# EAGLE design dac connector board (EAGLE 6.3)
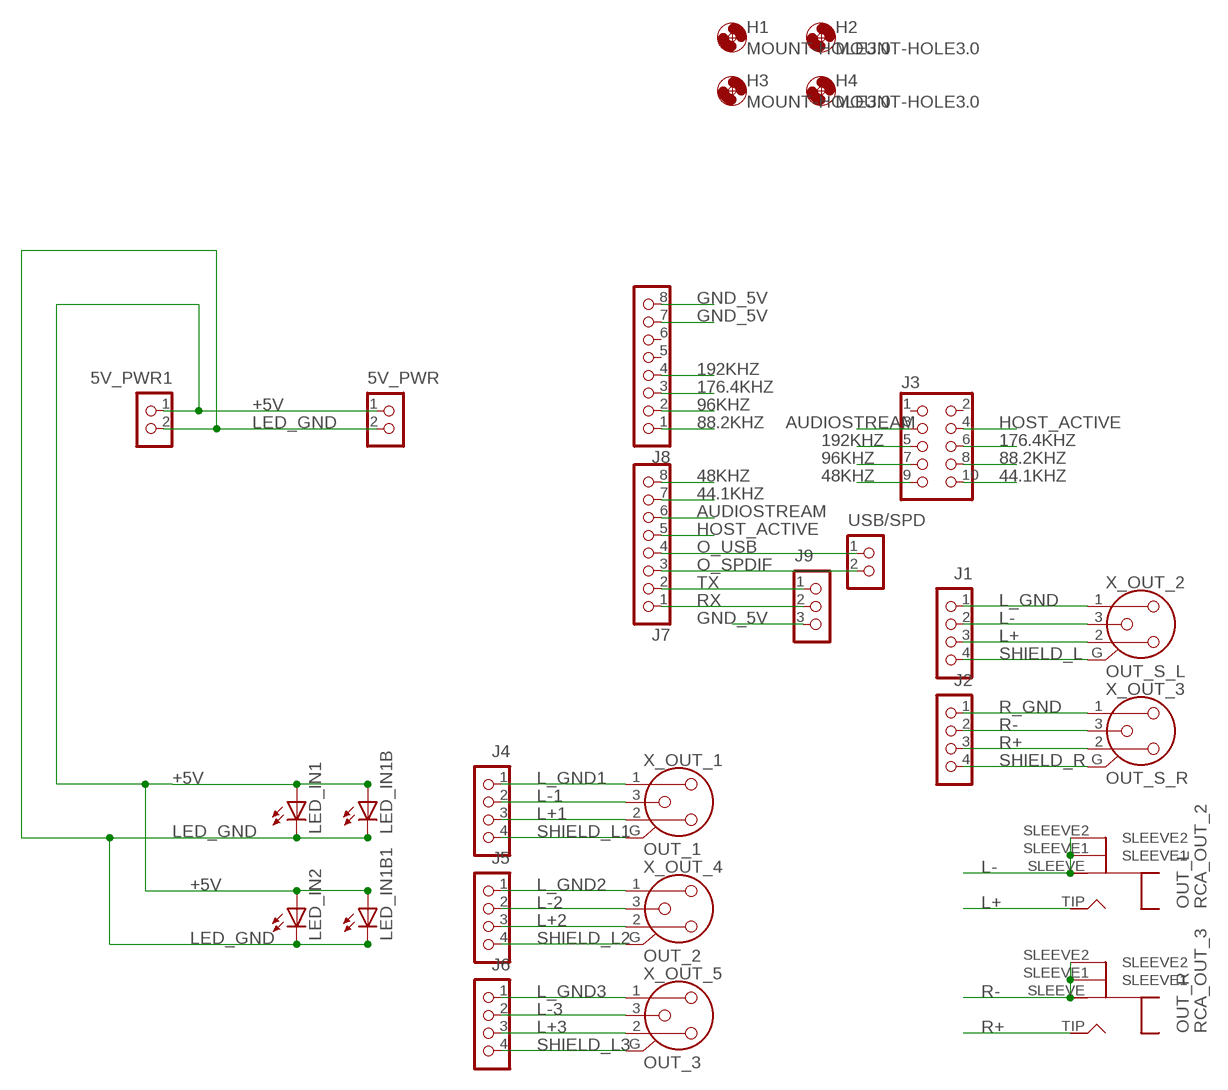
[diagram p0: schematic, sheet 1]

## Parts
5V_PWR  5V PWR  CON_HEADER_1X02-PTH  [M1X2]
5V_PWR1  5V PWR  CON_HEADER_1X02-PTH  [M1X2]
H1  MOUNT-HOLE3.0  [3,0]
H2  MOUNT-HOLE3.0  [3,0]
H3  MOUNT-HOLE3.0  [3,0]
H4  MOUNT-HOLE3.0  [3,0]
J1  CON_HEADER_1X04  [M1X4]
J2  CON_HEADER_1X04  [M1X4]
J3  DAC  CON_HEADER_2X05-PTH  [M2X5]
J4  CON_OUT_1  CON_HEADER_1X04  [M1X4]
J5  CON_OUT_2  CON_HEADER_1X04  [M1X4]
J6  CON_OUT_3  CON_HEADER_1X04  [M1X4]
J7  ARD1  CON_HEADER_1X08-PTH  [M1X8]
J8  ARD2  CON_HEADER_1X08-PTH  [M1X8]
J9  SERIAL  CON_HEADER_1X03-PTH  [M1X3]
LED_IN1  TLLG4400  [LED3MM]
LED_IN1B  TLLG4400  [LED3MM]
LED_IN1B1  TLLG4400  [LED3MM]
LED_IN2  TLLG4400  [LED3MM]
RCA_OUT_2  OUT_L  MONO_JACKGAEL  [MONO_JACK]
RCA_OUT_3  OUT_R  MONO_JACKGAEL  [MONO_JACK]
USB/SPD  IN_SEL  CON_HEADER_1X02-PTH  [M1X2]
X_OUT_1  OUT_1  NC3MBH  [NC3MBH]
X_OUT_2  OUT_S_L  NC3MBH  [NC3MBH]
X_OUT_3  OUT_S_R  NC3MBH  [NC3MBH]
X_OUT_4  OUT_2  NC3MBH  [NC3MBH]
X_OUT_5  OUT_3  NC3MBH  [NC3MBH]

## Nets
44.1KHZ: J3.10 J7.7
48KHZ: J3.9 J7.8
88.2KHZ: J3.8 J8.1
96KHZ: J3.7 J8.2
176.4KHZ: J3.6 J8.3
192KHZ: J3.5 J8.4
+5V [power]: 5V_PWR1.1 5V_PWR.1 LED_IN1.A LED_IN1B1.A LED_IN1B.A LED_IN2.A
AUDIOSTREAM: J3.3 J7.6
GND_5V: J8.7 J8.8 J9.3
HOST_ACTIVE: J3.4 J7.5
L+: J1.3 RCA_OUT_2.TIP X_OUT_2.2
L+1: J4.3 X_OUT_1.2
L+2: J5.3 X_OUT_4.2
L+3: J6.3 X_OUT_5.2
L-: J1.2 RCA_OUT_2.SLEEVE RCA_OUT_2.SLEEVE1 RCA_OUT_2.SLEEVE2 X_OUT_2.3
L-1: J4.2 X_OUT_1.3
L-2: J5.2 X_OUT_4.3
L-3: J6.2 X_OUT_5.3
L_GND: J1.1 X_OUT_2.1
L_GND1: J4.1 X_OUT_1.1
L_GND2: J5.1 X_OUT_4.1
L_GND3: J6.1 X_OUT_5.1
LED_GND: 5V_PWR1.2 5V_PWR.2 LED_IN1.K(C) LED_IN1B1.K(C) LED_IN1B.K(C) LED_IN2.K(C)
O_SPDIF: J7.3 USB/SPD.2
O_USB: J7.4 USB/SPD.1
R+: J2.3 RCA_OUT_3.TIP X_OUT_3.2
R-: J2.2 RCA_OUT_3.SLEEVE RCA_OUT_3.SLEEVE1 RCA_OUT_3.SLEEVE2 X_OUT_3.3
R_GND: J2.1 X_OUT_3.1
RX: J7.1 J9.2
SHIELD_L: J1.4 X_OUT_2.G
SHIELD_L1: J4.4 X_OUT_1.G
SHIELD_L2: J5.4 X_OUT_4.G
SHIELD_L3: J6.4 X_OUT_5.G
SHIELD_R: J2.4 X_OUT_3.G
TX: J7.2 J9.1
Unconnected: J3.1 J3.2 J8.5 J8.6

## Library data of the parts
5V_PWR 5V_PWR1 USB/SPD = dp_devices:CON_HEADER_1X02
H1-H4 = holes:MOUNT-HOLE: MOUNTING HOLE with drill center marker
J1 J2 J4-J6 = dp_devices.v6:CON_HEADER_1X04
J3 = dp_devices:CON_HEADER_2X05: 2x05 pin header
J7 J8 = dp_devices:CON_HEADER_1X08
J9 = dp_devices:CON_HEADER_1X03
LED_IN1 LED_IN1B LED_IN1B1 LED_IN2 = led:TLLG4400: Low Current (2mA) LED 3 mm Tinted Diffused Package color GREEN Source: Data sheet <http://www.farnell.com/datasheets/391098.pdf>; MF: VISHAY SEMICONDUCTOR; OC_FARNELL: 1612435
RCA_OUT_2 RCA_OUT_3 = 00_steve:MONO_JACK
X_OUT_1-X_OUT_5 = con-neutrik_ag:NC3: Neutrik Audio Connector XLR SERIES Stereo 1/4" jack Source: www.neutrik.com/; MF: NEUTRIK; MPN: NC3MBH; OC_FARNELL: unknown; OC_NEWARK: 91F3470

## Net classes
0 default: width 0.203 mm, clearance 0.203 mm
4 power: width 0.381 mm, clearance 0.203 mm

## Board
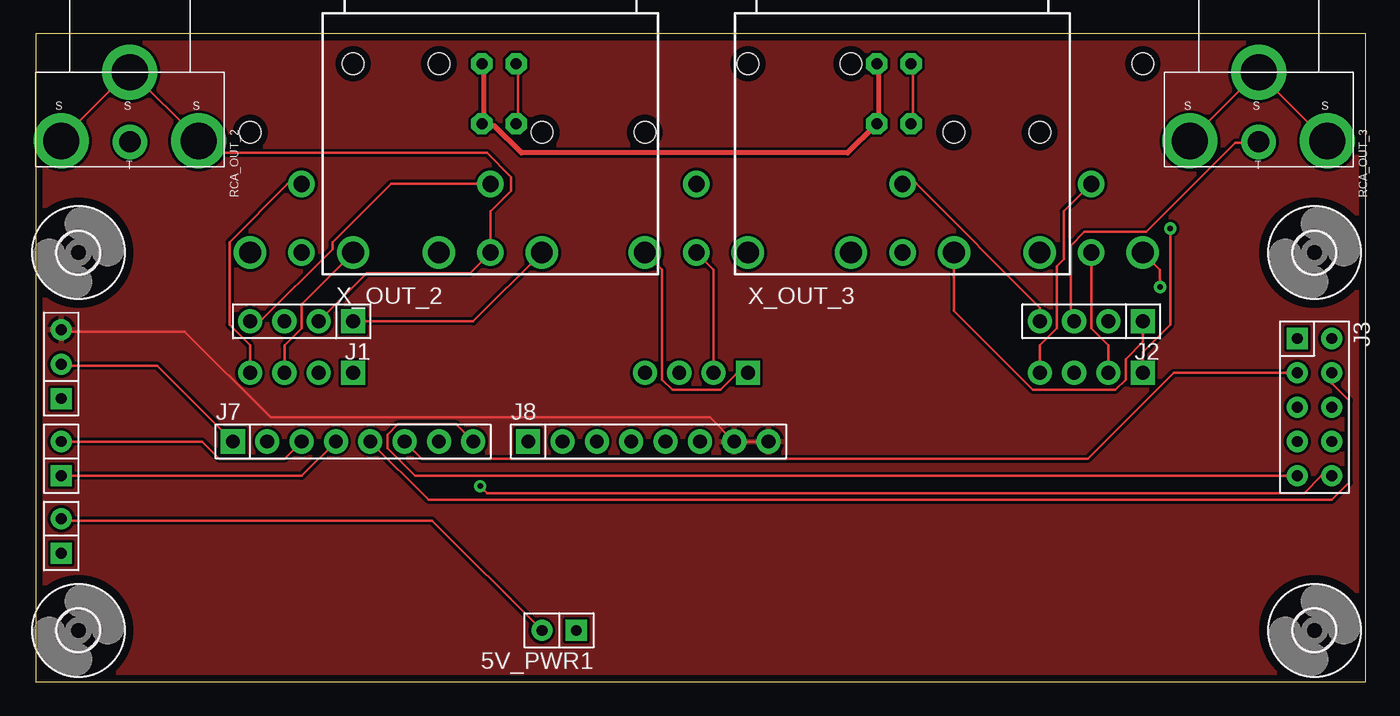
[diagram p1: board, top side]
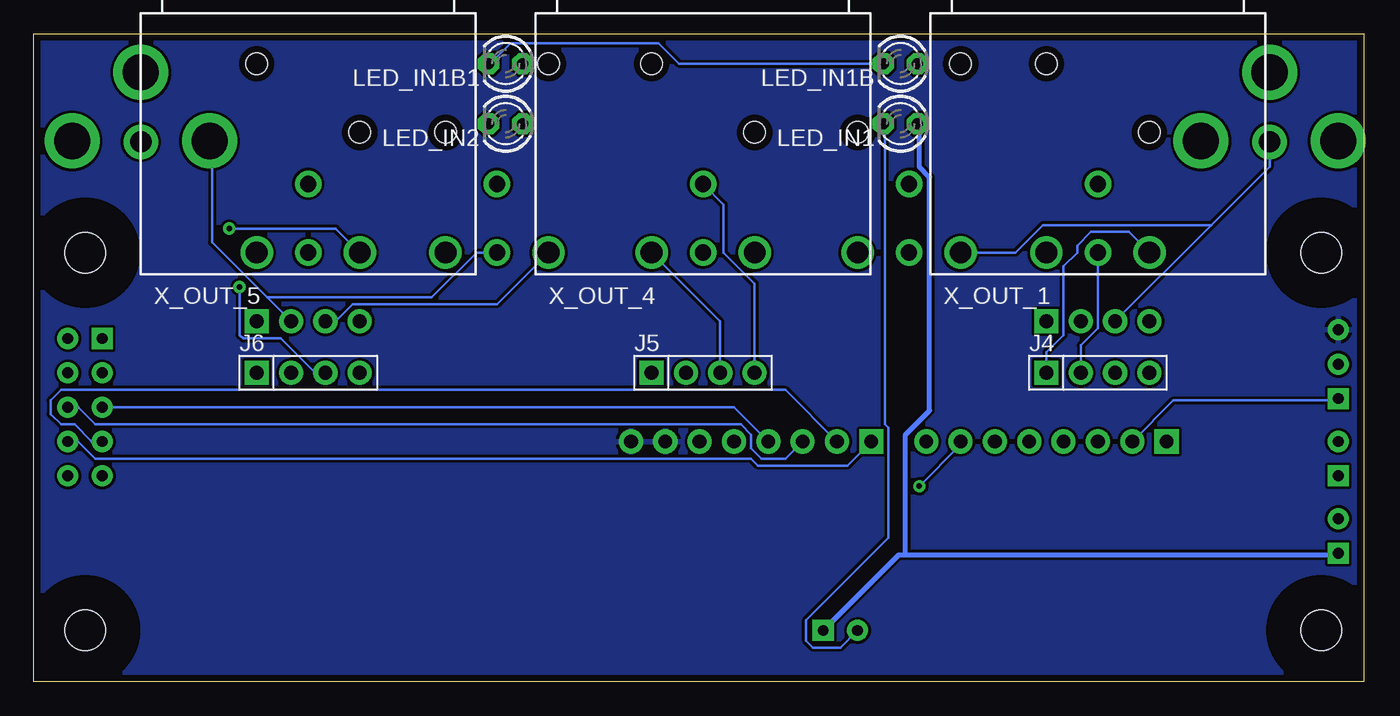
[diagram p2: board, bottom side, seen from below]

Size 98.41 x 47.93 mm. Coordinates in mm from the lower left corner, seen from the top.
Outline: 0,0 98.41,0 98.41,47.93 0,47.93 0,0
Copper layers (1*16): Top 0.035mm / dielectric 1.5mm / Bottom 0.035mm
Design rules "gael design rules": minimum track width 0.2mm, minimum drill 0.4mm, track to track 8mil, track to pad 8mil, pad to pad 8mil, via to via 8mil, smd to smd 8mil, copper to edge 20mil, drill to drill 8mil, minimum pad ring 15mil, minimum via ring 10mil, stop-mask expansion 4mil, vias tented up to drill 0mil, thermal gap 10mil

### Footprints (pad centres in the part's own frame; a part is rotated, then mirrored left to right if it is on the bottom)
M1X2 = drill 0.8 square: 1 -1.27,0 | drill 0.8: 2 1.27,0
3,0 = hole 3: 0,0
M1X4 = drill 1.02 pad 1.632 square: 1 0,0 | drill 1.02 pad 1.632: 2 2.54,0; 3 5.08,0; 4 7.62,0
M2X5 = drill 0.8 square: 1 -5.08,-1.27 | drill 0.8: 2 -5.08,1.27; 3 -2.54,-1.27; 4 -2.54,1.27; 5 0,-1.27; 6 0,1.27; 7 2.54,-1.27; 8 2.54,1.27; 9 5.08,-1.27; 10 5.08,1.27
M1X8 = drill 1.02 pad 1.632 square: 1 -8.89,0 | drill 1.02 pad 1.632: 2 -6.35,0; 3 -3.81,0; 4 -1.27,0; 5 1.27,0; 6 3.81,0; 7 6.35,0; 8 8.89,0
M1X3 = drill 0.8 square: 1 0,0 | drill 0.8: 2 2.54,0; 3 5.08,0
LED3MM = drill 0.813 octagon: A -1.27,0; K 1.27,0
MONO_JACK = drill 2.667 pad 4.064: SLEEVE 7.62,0; SLEEVE1 -2.54,0; SLEEVE2 2.54,-5.08 | drill 1.575 pad 2.54: TIP 2.54,0.064
NC3MBH = drill 1.6: 1 3.81,0; 2 -3.81,0 | drill 1.2: 3 0,0; G 0,5.08 | hole 1.6: -3.81,13.97; 3.81,8.89

### Placement (x,y rotation side)
5V_PWR  1.91,10.8 90 top
5V_PWR1  38.73,3.81 180 top
H1  94.61,31.75 0 top
H2  3.17,31.75 0 top
H3  94.61,3.81 0 top
H4  3.17,3.81 0 top
J1  23.5,26.67 180 top
J2  81.92,26.67 180 top
J3  94.61,20.32 270 top
J4  23.5,22.86 0 bottom
J5  52.7,22.86 0 bottom
J6  81.92,22.86 0 bottom
J7  23.5,17.78 0 top
J8  45.34,17.78 0 top
J9  1.91,20.96 90 top
LED_IN1  34.29,41.27 180 bottom
LED_IN1B  34.29,45.72 180 bottom
LED_IN1B1  63.5,45.72 180 bottom
LED_IN2  63.5,41.27 180 bottom
RCA_OUT_2  9.53,40.01 180 top
RCA_OUT_3  93.03,40.01 180 top
USB/SPD  1.91,16.51 90 top
X_OUT_1  19.69,31.75 0 bottom
X_OUT_2  33.66,31.75 0 top
X_OUT_3  64.13,31.75 0 top
X_OUT_4  48.9,31.75 0 bottom
X_OUT_5  78.11,31.75 0 bottom

### Tracks (layer width: path | path; a pad name or v marks a point on that pad's centre or on a via)
44.1KHZ  (via drill 0.4)
  Top 0.203: J3.10 95.12,15.24 93.85,13.97 33.4,13.97 v32.89,14.48
  Bottom 0.203: v32.89,14.48 29.85,17.53 J7.7
48KHZ
  Top 0.203: J3.9 28.07,15.24 26.04,17.27 26.04,18.29 26.8,19.05 31.12,19.05 J7.8
88.2KHZ
  Bottom 0.203: J3.8 95.12,17.78 93.85,16.51 45.34,16.51 44.83,16 38.23,16 J8.1
96KHZ
  Bottom 0.203: J3.7 94.11,17.78 95.38,19.05 96.39,19.05 97.16,19.81 97.16,20.83 96.39,21.59 42.8,21.59 J8.2
176.4KHZ
  Bottom 0.203: J3.6 95.12,20.32 93.85,19.05 46.1,19.05 45.34,18.29 45.34,17.27 44.58,16.51 42.8,16.51 J8.3
192KHZ
  Bottom 0.203: J3.5 46.61,20.32 J8.4
+5V
  Top 0.381: 33.15,45.72 33.15,41.4 LED_IN1.A 33.15,41.15 33.91,41.15 35.94,39.12 60.07,39.12 62.1,41.15 LED_IN2.A 62.36,41.4 62.36,45.72 | 33.15,45.72 LED_IN1B.A | 33.15,45.72 LED_IN1B.A | 33.15,45.72 LED_IN1B.A | 62.36,45.72 LED_IN1B1.A | 62.36,45.72 LED_IN1B1.A | 62.36,45.72 LED_IN1B1.A
  Bottom 0.381: 33.91,9.4 34.42,9.4 5V_PWR1.1 | 33.91,9.4 1.91,9.4 5V_PWR.1 | 33.91,9.4 33.91,18.29 32.13,20.07 32.13,37.34 32.89,38.1 32.89,41.15 LED_IN1.A
AUDIOSTREAM
  Top 0.203: J3.3 84.2,22.86 77.85,16.51 28.58,16.51 J7.6
GND_5V
  Top 0.203: J9.3 1.91,25.91 11.05,25.91 17.4,19.56 49.91,19.56 J8.7 J8.8
  pour Top: 0,49.53 98.42,49.53 98.42,0 0,0
  pour Bottom: 0,49.53 98.42,49.53 98.42,0 0,0
HOST_ACTIVE
  Top 0.203: J3.4 95.89,22.1 97.16,20.83 97.16,14.73 95.89,13.46 29.08,13.46 J7.5
L+
  Bottom 0.203: 11.3,33.78 6.99,38.1 6.99,39.88 RCA_OUT_2.TIP | 11.3,33.78 J1.3 | X_OUT_2.2 25.78,31.75 23.75,33.78 11.3,33.78
L+1
  Top 0.203: J4.3 18.42,24.89 19.69,26.16 19.69,27.94 X_OUT_1.2
L+2
  Bottom 0.203: J5.3 47.62,26.67 X_OUT_4.2
L+3  (via drill 0.4)
  Top 0.203: v83.19,29.21 83.19,30.48 X_OUT_5.2
  Bottom 0.203: J6.3 77.6,22.86 80.14,25.4 82.93,25.4 83.19,25.65 v83.19,29.21
L-
  Top 0.203: J1.2 24.51,30.23 32.13,30.23 X_OUT_2.3 33.66,34.8 35.18,36.32 35.18,37.34 33.4,39.12 12.83,39.12 12.06,39.88 RCA_OUT_2.SLEEVE1 12.06,40.13 6.99,45.21 | 6.99,45.21 1.91,40.13 RCA_OUT_2.SLEEVE | 6.99,45.21 RCA_OUT_2.SLEEVE2 6.99,45.21
L-1
  Bottom 0.203: J4.2 20.96,24.89 19.69,26.16 X_OUT_1.3
L-2
  Top 0.203: J5.2 50.16,30.48 X_OUT_4.3
L-3
  Top 0.203: J6.2 79.38,24.89 78.11,26.16 X_OUT_5.3
L_GND
  Top 0.203: J1.1 32.38,26.67 X_OUT_2.1
L_GND1
  Bottom 0.203: J4.1 23.5,24.38 22.23,25.65 22.23,30.73 21.21,31.75 21.21,32.26 20.19,33.27 17.4,33.27 X_OUT_1.1
L_GND2
  Top 0.203: J5.1 51.94,22.86 50.67,21.59 47.12,21.59 46.36,22.35 46.36,30.48 X_OUT_4.1
L_GND3  (via drill 0.4)
  Top 0.203: J6.1 81.92,24.38 83.95,26.42 v83.95,33.53
  Bottom 0.203: v83.95,33.53 76.07,33.53 X_OUT_5.1
LED_GND
  Top 0.203: LED_IN1.K 35.69,41.4 35.69,45.72 LED_IN1B.K | LED_IN2.K 64.9,41.4 64.9,45.72 LED_IN1B1.K | 5V_PWR1.2 29.34,11.94 1.91,11.94 5V_PWR.2
  Bottom 0.203: LED_IN1B.K 35.69,45.72 50.67,45.72 52.2,47.24 63.12,47.24 64.64,45.72 LED_IN1B1.K | 5V_PWR1.2 38.73,2.54 40.77,2.54 41.27,3.05 41.27,4.57 35.18,10.67 35.18,18.8 35.43,19.05 35.43,41.15 LED_IN1.K
O_SPDIF
  Top 0.203: USB/SPD.2 12.32,17.78 13.59,16.51 18.42,16.51 J7.3
O_USB
  Top 0.203: USB/SPD.1 19.69,15.24 J7.4
R+
  Top 0.203: J2.3 76.58,26.92 76.58,32.26 77.6,33.27 82.17,33.27 88.77,39.88 90.3,39.88 RCA_OUT_3.TIP
  Bottom 0.203: J2.3 76.07,26.67 74.8,27.94 64.13,27.94 X_OUT_3.2
R-
  Top 0.203: RCA_OUT_3.SLEEVE1 95.38,40.13 90.55,44.96 RCA_OUT_3.SLEEVE2 90.3,44.96 85.47,40.13 RCA_OUT_3.SLEEVE
  Bottom 0.203: 81.15,28.45 85.22,32.51 85.22,39.88 RCA_OUT_3.SLEEVE | 81.15,28.45 J2.2 | X_OUT_3.3 65.66,31.75 68.96,28.45 81.15,28.45
R_GND
  Top 0.203: J2.1 81.92,25.15 80.64,23.88 80.64,22.35 79.88,21.59 73.79,21.59 67.95,27.43 X_OUT_3.1
RX
  Top 0.203: J7.1 9.02,23.37 1.91,23.37 J9.2
SHIELD_L
  Top 0.203: J1.4 16.64,26.67 21.97,32 21.97,32.51 26.29,36.83 X_OUT_2.G
SHIELD_L1
  Top 0.203: J4.4 15.88,24.89 14.35,26.42 14.35,32.51 18.67,36.83 X_OUT_1.G
SHIELD_L2
  Bottom 0.203: J5.4 45.09,29.46 47.37,31.75 47.37,35.31 X_OUT_4.G
SHIELD_L3
  Top 0.203: J6.4 74.3,24.89 75.56,26.16 75.56,30.73 76.07,31.24 76.07,34.8 X_OUT_5.G
SHIELD_R
  Top 0.203: J2.4 74.3,27.69 65.15,36.83 X_OUT_3.G
TX
  Bottom 0.203: J7.2 14.1,20.83 1.91,20.83 J9.1

### Text on the board
tValues: GND | RX | TX | SPDIF | USB | GND_LED | +5V | GND_LED | +5V